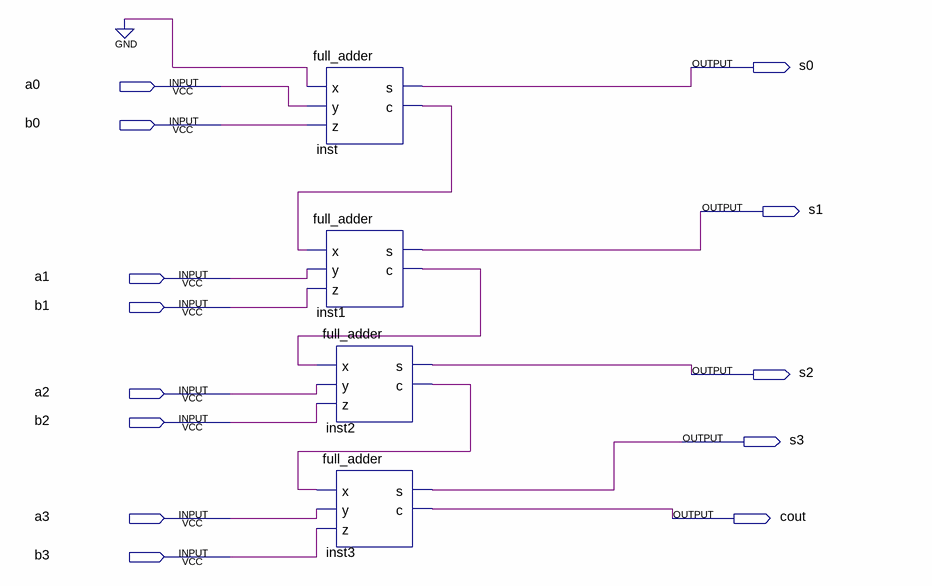
[diagram p0: schematic sheet]
// Quartus schematic adderProject.bdf as structural Verilog: 4 symbols, 13 pins
module adderProject (
  input  a0,
  input  b0,
  input  a1,
  input  b1,
  input  a2,
  input  b2,
  input  a3,
  input  b3,
  output s0,
  output s1,
  output s2,
  output s3,
  output cout
);

  wire inst1_c, inst2_c, inst_c;

  full_adder inst (.x(1'b0), .y(a0), .z(b0), .s(s0), .c(inst_c));
  full_adder inst1 (.x(inst_c), .y(a1), .z(b1), .s(s1), .c(inst1_c));
  full_adder inst2 (.x(inst1_c), .y(a2), .z(b2), .s(s2), .c(inst2_c));
  full_adder inst3 (.x(inst2_c), .y(a3), .z(b3), .s(s3), .c(cout));
endmodule
